# EAGLE schematic Power Supply Board (EAGLE 7.6.0)
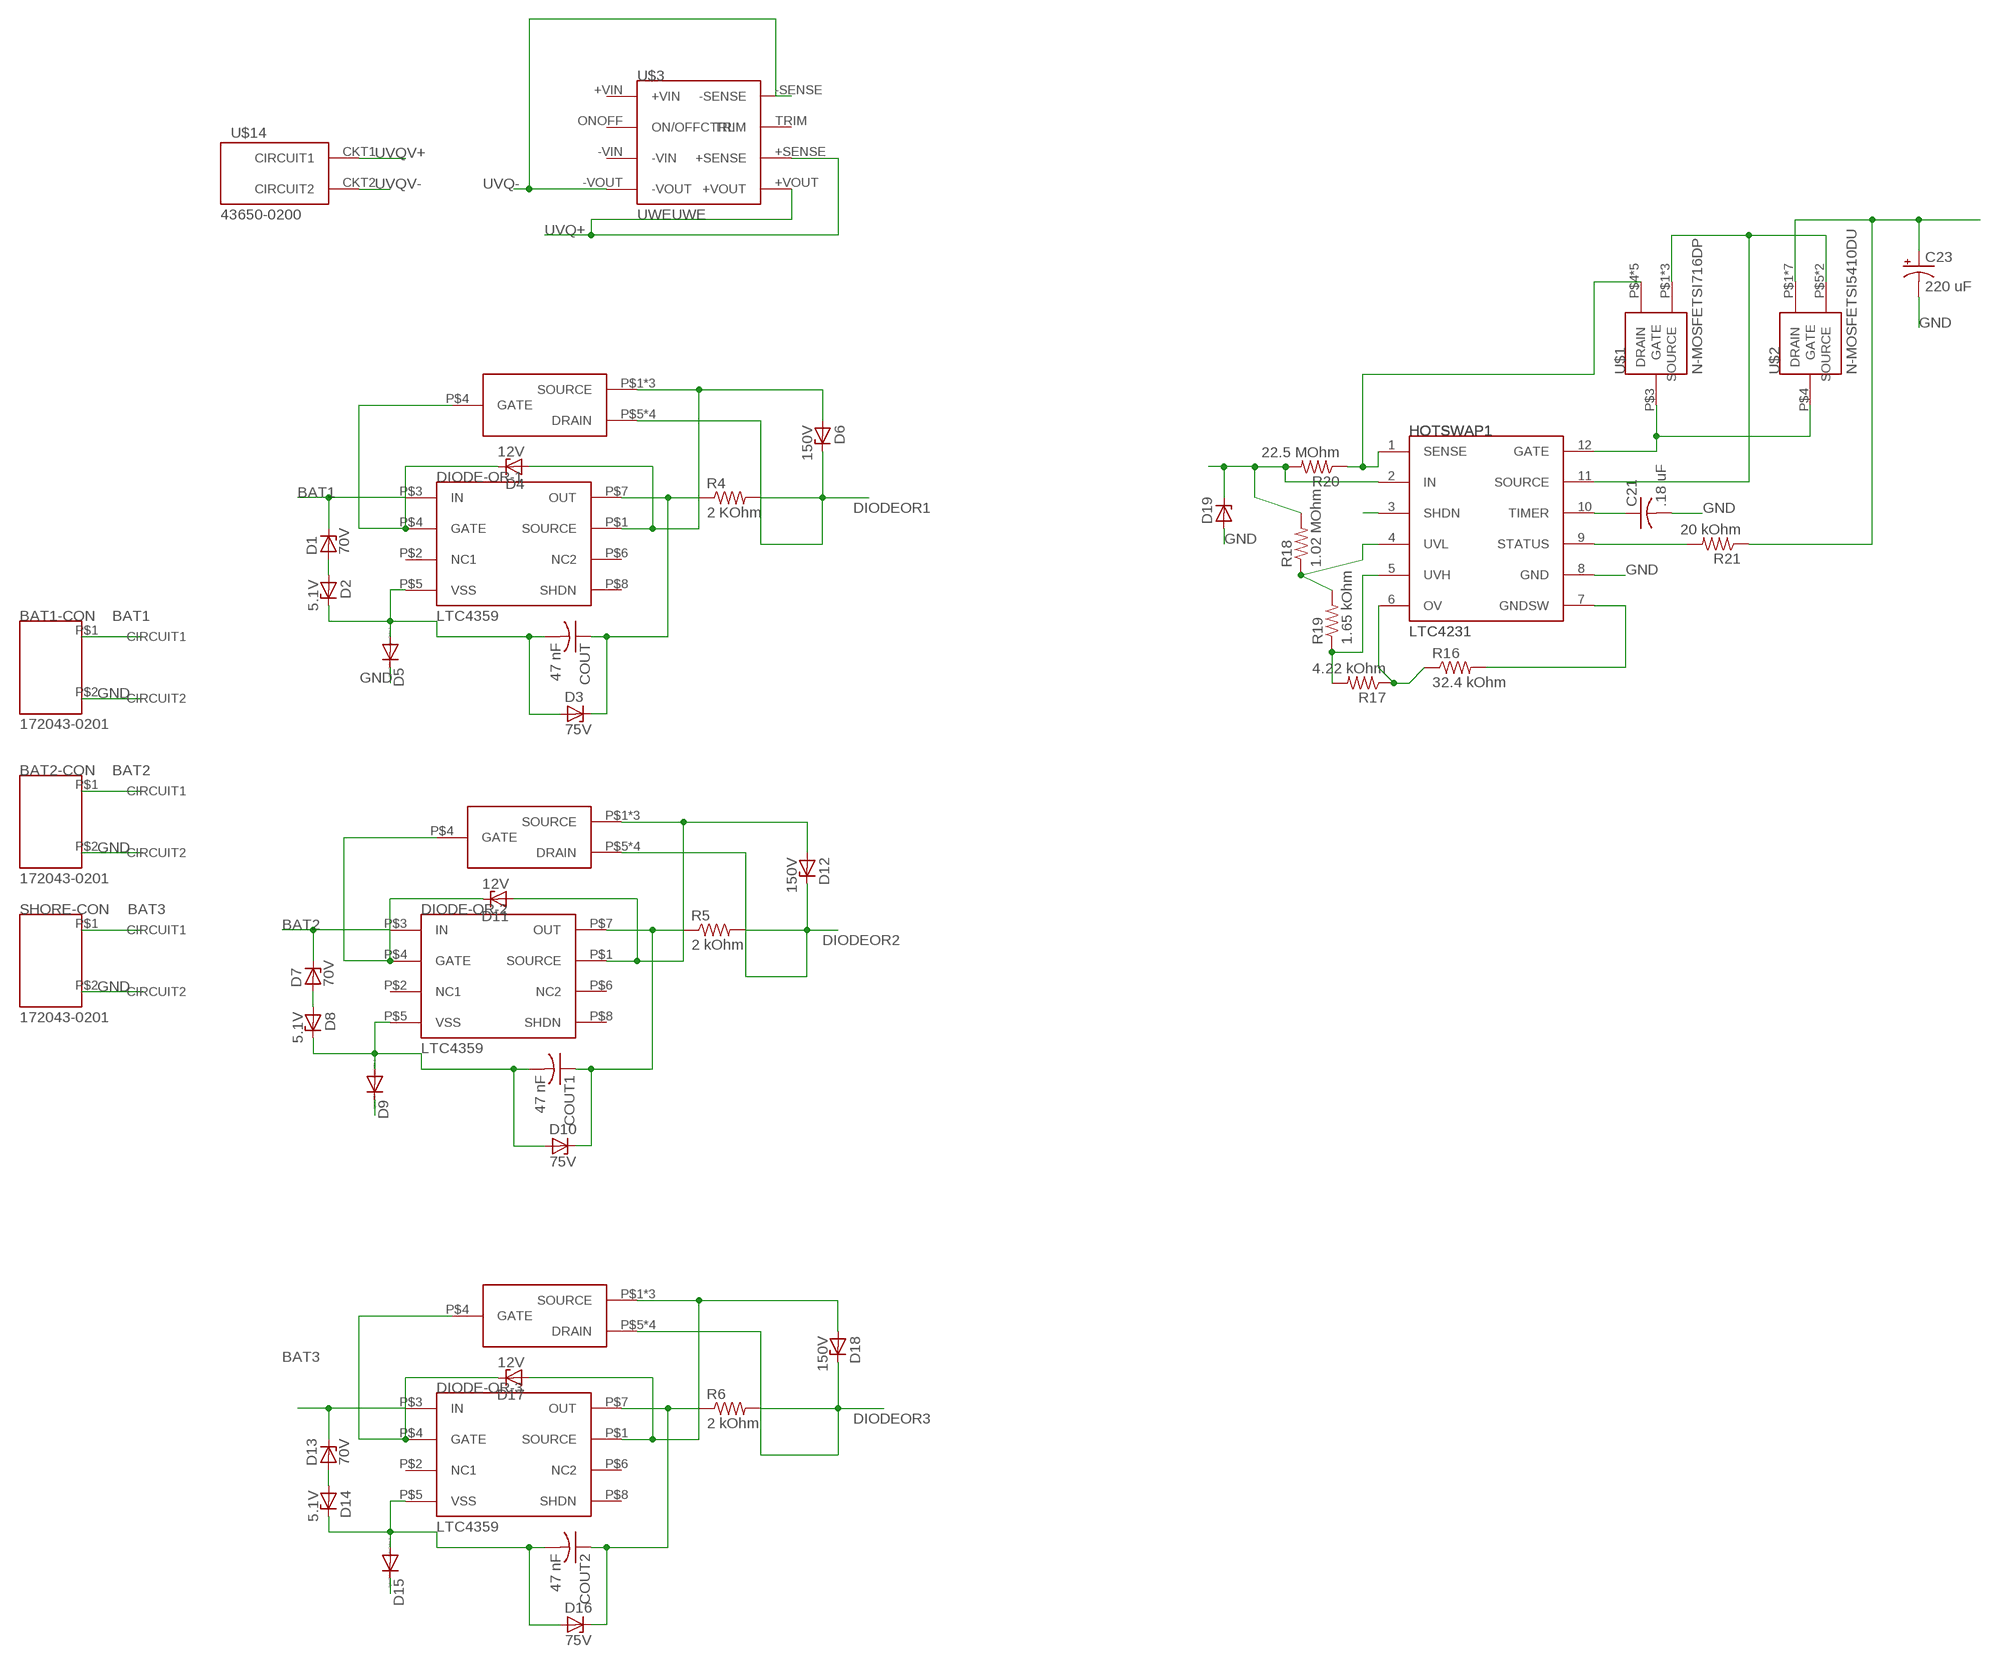
[diagram p0: schematic, sheet 1, part 1 of 2]
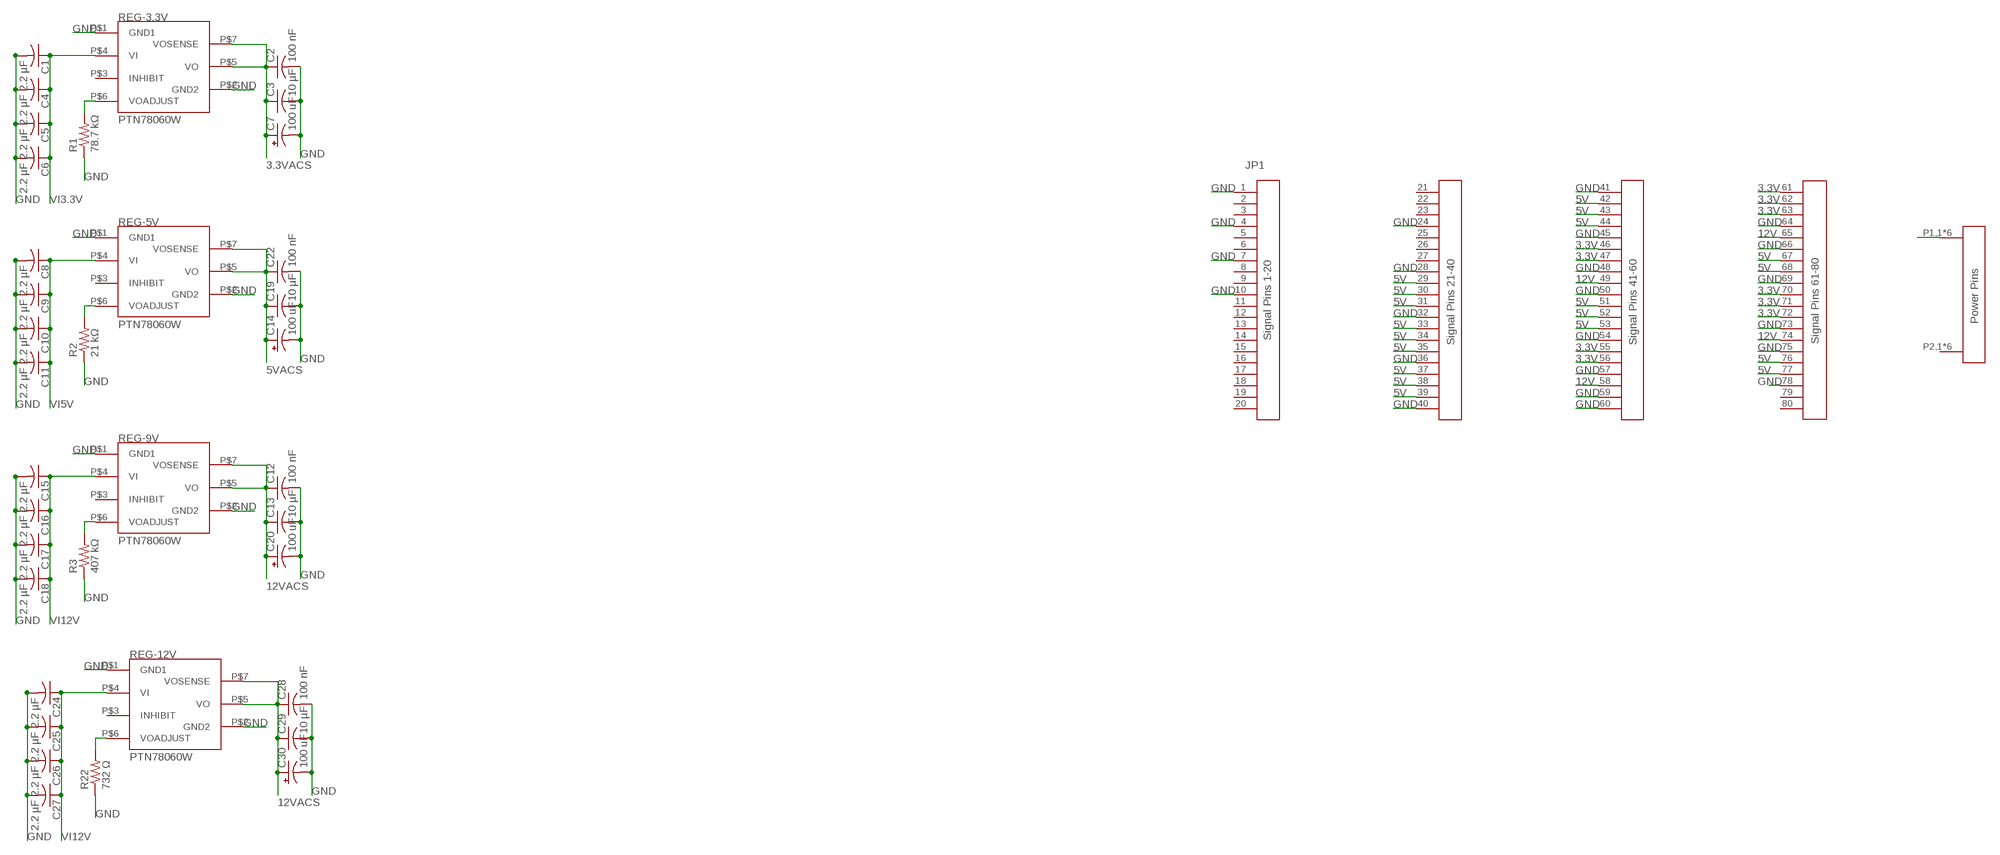
[diagram p1: schematic, sheet 1, part 2 of 2]

## Parts
BAT1-CON  172043-0201  [172043-0201]
BAT2-CON  172043-0201  [172043-0201]
C1  2.2 µF  C-USC1206  [C1206]
C2  100 nF  C-USC0603  [C0603]
C3  10 µF  C-USC0805  [C0805]
C4  2.2 µF  C-USC1206  [C1206]
C5  2.2 µF  C-USC1206  [C1206]
C6  2.2 µF  C-USC1206  [C1206]
C7  100 uF  CPOL-USD  [PANASONIC_D]
C8  2.2 µF  C-USC1206  [C1206]
C9  2.2 µF  C-USC1206  [C1206]
C10  2.2 µF  C-USC1206  [C1206]
C11  2.2 µF  C-USC1206  [C1206]
C12  100 nF  C-USC0603  [C0603]
C13  10 µF  C-USC0805  [C0805]
C14  100 uF  CPOL-USD  [PANASONIC_D]
C15  2.2 µF  C-USC1206  [C1206]
C16  2.2 µF  C-USC1206  [C1206]
C17  2.2 µF  C-USC1206  [C1206]
C18  2.2 µF  C-USC1206  [C1206]
C19  10 µF  C-USC0805  [C0805]
C20  100 uF  CPOL-USD  [PANASONIC_D]
C21  .18 uF  C-USC0603  [C0603]
C22  100 nF  C-USC0603  [C0603]
C23  220 uF  CPOL-USG  [PANASONIC_G]
C24  2.2 µF  C-USC1206  [C1206]
C25  2.2 µF  C-USC1206  [C1206]
C26  2.2 µF  C-USC1206  [C1206]
C27  2.2 µF  C-USC1206  [C1206]
C28  100 nF  C-USC0603  [C0603]
C29  10 µF  C-USC0805  [C0805]
C30  100 uF  CPOL-USD  [PANASONIC_D]
COUT  47 nF  C-USC0603  [C0603]
COUT1  47 nF  C-USC0603  [C0603]
COUT2  47 nF  C-USC0603  [C0603]
D1  70V  ZENER-DIODEC1702-15  [C1702-15]
D2  5.1V  ZENER-DIODEC1702-15  [C1702-15]
D3  75V  ZENER-DIODETO236  [TO236]
D4  12V  ZENER-DIODESMB  [SMB]
D5  DIODE-SOD123  [SOD123]
D6  150V  ZENER-DIODESMB  [SMB]
D7  70V  ZENER-DIODEC1702-15  [C1702-15]
D8  5.1V  ZENER-DIODEC1702-15  [C1702-15]
D9  DIODE-SOD123  [SOD123]
D10  75V  ZENER-DIODETO236  [TO236]
D11  12V  ZENER-DIODESMB  [SMB]
D12  150V  ZENER-DIODESMB  [SMB]
D13  70V  ZENER-DIODEC1702-15  [C1702-15]
D14  5.1V  ZENER-DIODEC1702-15  [C1702-15]
D15  DIODE-SOD123  [SOD123]
D16  75V  ZENER-DIODETO236  [TO236]
D17  12V  ZENER-DIODESMB  [SMB]
D18  150V  ZENER-DIODESMB  [SMB]
D19  ZENER-DIODESMAJ  [SMAJ]
DIODE-OR-1  LTC4359  [LTC4359]
DIODE-OR-2  LTC4359  [LTC4359]
DIODE-OR-3  LTC4359  [LTC4359]
HOTSWAP1  LTC4231  [LTC4231]
JP1  MPSC-01-80MPSC-RA-LC  [MPSC-01-80]
R1  78.7 kΩ  R-US_R0603  [R0603]
R2  21 kΩ  R-US_R0603  [R0603]
R3  407 kΩ  R-US_R0603  [R0603]
R4  2 KOhm  R-US_R0603  [R0603]
R5  2 kOhm  R-US_R0603  [R0603]
R6  2 kOhm  R-US_R0603  [R0603]
R16  32.4 kOhm  R-US_R0603  [R0603]
R17  4.22 kOhm  R-US_R0603  [R0603]
R18  1.02 MOhm  R-US_R0603  [R0603]
R19  1.65 kOhm  R-US_R0603  [R0603]
R20  22.5 MOhm  R-US_R0603  [R0603]
R21  20 kOhm  R-US_R0603  [R0603]
R22  732 Ω  R-US_R0603  [R0603]
REG-3.3V  PTN78060W  [PTN78060W]
REG-5V  PTN78060W  [PTN78060W]
REG-9V  PTN78060W  [PTN78060W]
REG-12V  PTN78060W  [PTN78060W]
SHORE-CON  172043-0201  [172043-0201]
U$1  N-MOSFETSI716DP  [SI7164DP]
U$2  N-MOSFETSI5410DU  [SI5410DU]
U$3  UWEUWE  [UWE]
U$5  CSD19537Q3  [CSD19537Q3]
U$6  CSD19537Q3  [CSD19537Q3]
U$14  43650-0200  [43650-0200]
U$18  CSD19537Q3  [CSD19537Q3]

## Nets
3.3V: JP1.46 JP1.47 JP1.55 JP1.56 JP1.61 JP1.62 JP1.63 JP1.70 JP1.71 JP1.72
3.3VACS: C2.1 C3.1 C7.+ REG-3.3V.P$5(VO) REG-3.3V.P$7(VOSENSE)
5V: JP1.29 JP1.30 JP1.31 JP1.33 JP1.34 JP1.35 JP1.37 JP1.38 JP1.39 JP1.42 JP1.43 JP1.44 JP1.51 JP1.52 JP1.53 JP1.67 JP1.68 JP1.76 JP1.77
5VACS: C14.+ C19.1 C22.1 REG-5V.P$5(VO) REG-5V.P$7(VOSENSE)
12V: JP1.49 JP1.58 JP1.65 JP1.74
12VACS: C12.1 C13.1 C20.+ C28.1 C29.1 C30.+ REG-9V.P$5(VO) REG-9V.P$7(VOSENSE) REG-12V.P$5(VO) REG-12V.P$7(VOSENSE)
BAT1: BAT1-CON.P$1(CIRCUIT1) D1.C DIODE-OR-1.P$3(IN)
BAT2: BAT2-CON.P$1(CIRCUIT1) D7.C DIODE-OR-2.P$3(IN)
BAT3: D13.C DIODE-OR-3.P$3(IN) SHORE-CON.P$1(CIRCUIT1)
DIODEOR1: D6.C R4.2 U$18.P$5(DRAIN) U$18.P$6(DRAIN) U$18.P$7(DRAIN) U$18.P$8(DRAIN)
DIODEOR2: D12.C R5.2 U$5.P$5(DRAIN) U$5.P$6(DRAIN) U$5.P$7(DRAIN) U$5.P$8(DRAIN)
DIODEOR3: D18.C R6.2 U$6.P$5(DRAIN) U$6.P$6(DRAIN) U$6.P$7(DRAIN) U$6.P$8(DRAIN)
GATE1: D4.C DIODE-OR-1.P$4(GATE) U$18.P$4(GATE)
GATE2: D17.C DIODE-OR-3.P$4(GATE) U$6.P$4(GATE)
GATE7: D11.C DIODE-OR-2.P$4(GATE) U$5.P$4(GATE)
GND: BAT1-CON.P$2(CIRCUIT2) BAT2-CON.P$2(CIRCUIT2) C1.2 C2.2 C3.2 C4.2 C5.2 C6.2 C7.- C8.2 C9.2 C10.2 C11.2 C12.2 C13.2 C14.- C15.2 C16.2 C17.2 C18.2 C19.2 C20.- C21.2 C22.2 C23.- C24.2 C25.2 C26.2 C27.2 C28.2 C29.2 C30.- D5.C D9.C D19.P$2(A) HOTSWAP1.8(GND) JP1.1 JP1.4 JP1.7 JP1.10 JP1.24 JP1.28 JP1.32 JP1.36 JP1.40 JP1.41 JP1.45 JP1.48 JP1.50 JP1.54 JP1.57 JP1.59 JP1.60 JP1.64 JP1.66 JP1.69 JP1.73 JP1.75 JP1.78 R1.1 R2.1 R3.1 R22.1 REG-3.3V.P$1(GND1) REG-3.3V.P$2(GND2) REG-5V.P$1(GND1) REG-5V.P$2(GND2) REG-9V.P$1(GND1) REG-9V.P$2(GND2) REG-12V.P$1(GND1) REG-12V.P$2(GND2) SHORE-CON.P$2(CIRCUIT2)
GND1: D15.C
N$1: JP1.P1,1(POWER1) JP1.P1,2(POWER1) JP1.P1,3(POWER1) JP1.P1,4(POWER1) JP1.P1,5(POWER1) JP1.P1,6(POWER1)
N$2: R2.2 REG-5V.P$6(VOADJUST)
N$3: R1.2 REG-3.3V.P$6(VOADJUST)
N$4: R3.2 REG-9V.P$6(VOADJUST)
N$5: D1.A D2.A
N$6: COUT.1 D3.C DIODE-OR-1.P$7(OUT) R4.1
N$7: COUT.2 D2.C D3.A D5.A DIODE-OR-1.P$5(VSS)
N$8: D7.A D8.A
N$9: COUT1.2 D8.C D9.A D10.A DIODE-OR-2.P$5(VSS)
N$10: COUT1.1 D10.C DIODE-OR-2.P$7(OUT) R5.1
N$11: D13.A D14.A
N$12: COUT2.2 D14.C D15.A D16.A DIODE-OR-3.P$5(VSS)
N$13: COUT2.1 D16.C DIODE-OR-3.P$7(OUT) R6.1
N$14: C21.1 HOTSWAP1.10(TIMER)
N$15: HOTSWAP1.7(GNDSW) R16.2
N$16: HOTSWAP1.6(OV) R16.1 R17.1
N$17: HOTSWAP1.4(UVL) R18.1 R19.2
N$26: HOTSWAP1.5(UVH) R17.2 R19.1
N$27: HOTSWAP1.1(SENSE) R20.1 U$1.P$4(DRAIN) U$1.P$6(DRAIN) U$1.P$7(DRAIN) U$1.P$8(DRAIN) U$1.P$9(DRAIN)
N$32: HOTSWAP1.12(GATE) U$1.P$3(GATE) U$2.P$4(GATE)
N$33: D19.P$1(C) HOTSWAP1.2(IN) R18.2 R20.2
N$34: HOTSWAP1.11(SOURCE) U$1.P$1(SOURCE) U$1.P$2(SOURCE) U$1.P$5(SOURCE) U$2.P$5(SOURCE) U$2.P$9(SOURCE)
N$35: C23.+ R21.1 U$2.P$1(DRAIN) U$2.P$2(DRAIN) U$2.P$3(DRAIN) U$2.P$6(DRAIN) U$2.P$7(DRAIN) U$2.P$8(DRAIN) U$2.P$10(DRAIN)
N$36: HOTSWAP1.9(STATUS) R21.2
N$37: R22.2 REG-12V.P$6(VOADJUST)
SHDN-HOT-1: HOTSWAP1.3(SHDN)
SOURCE1: D4.A D6.A DIODE-OR-1.P$1(SOURCE) U$18.P$1(SOURCE) U$18.P$2(SOURCE) U$18.P$3(SOURCE)
SOURCE2: D17.A D18.A DIODE-OR-3.P$1(SOURCE) U$6.P$1(SOURCE) U$6.P$2(SOURCE) U$6.P$3(SOURCE)
SOURCE7: D11.A D12.A DIODE-OR-2.P$1(SOURCE) U$5.P$1(SOURCE) U$5.P$2(SOURCE) U$5.P$3(SOURCE)
UVQ+: U$3.+SENSE U$3.+VOUT
UVQ-: U$3.-SENSE U$3.-VOUT
UVQV+: U$14.CKT1(CIRCUIT1)
UVQV-: U$14.CKT2(CIRCUIT2)
VI3.3V: C1.1 C4.1 C5.1 C6.1 REG-3.3V.P$4(VI)
VI5V: C8.1 C9.1 C10.1 C11.1 REG-5V.P$4(VI)
VI12V: C15.1 C16.1 C17.1 C18.1 C24.1 C25.1 C26.1 C27.1 REG-9V.P$4(VI) REG-12V.P$4(VI)
Unconnected: DIODE-OR-1.P$2(NC1) DIODE-OR-1.P$6(NC2) DIODE-OR-1.P$8(SHDN) DIODE-OR-2.P$2(NC1) DIODE-OR-2.P$6(NC2) DIODE-OR-2.P$8(SHDN) DIODE-OR-3.P$2(NC1) DIODE-OR-3.P$6(NC2) DIODE-OR-3.P$8(SHDN) JP1.2 JP1.3 JP1.5 JP1.6 JP1.8 JP1.9 JP1.11 JP1.12 JP1.13 JP1.14 JP1.15 JP1.16 JP1.17 JP1.18 JP1.19 JP1.20 JP1.21 JP1.22 JP1.23 JP1.25 JP1.26 JP1.27 JP1.79 JP1.80 JP1.P2,1(POWER2) JP1.P2,2(POWER2) JP1.P2,3(POWER2) JP1.P2,4(POWER2) JP1.P2,5(POWER2) JP1.P2,6(POWER2) REG-3.3V.P$3(INHIBIT) REG-5V.P$3(INHIBIT) REG-9V.P$3(INHIBIT) REG-12V.P$3(INHIBIT) U$3.+VIN U$3.-VIN U$3.ONOFF(ON/OFFCTRL) U$3.TRIM

## Library data of the parts
BAT1-CON BAT2-CON SHORE-CON = molex:172043-0201
C1-C6 C8-C13 C15-C19 C21 C22 C24-C29 COUT COUT1 COUT2 = resistor:C-US: CAPACITOR, American symbol
C7 C14 C20 C23 C30 = resistor:CPOL-US: POLARIZED CAPACITOR, American symbol
D1-D4 D6-D8 D10-D14 D16-D19 = diode:ZENER-DIODE: Z-Diode
D5 D9 D15 = diode:DIODE-: DIODE
DIODE-OR-1-DIODE-OR-3 = linear:LTC4359
HOTSWAP1 = linear:LTC4231
JP1 = samtec:MPSC-01-80
R1-R6 R16-R22 = resistor:R-US_: RESISTOR, American symbol
REG-3.3V REG-5V REG-9V REG-12V = texas:PTN78060W
U$1 U$2 = vishay:N-MOSFET
U$3 = murata:UWE
U$5 U$6 U$18 = texas:CSD19537Q3
U$14 = molex:43650-0200